# Altium schematic sheet Root.SchDoc
size A3; SheetNumber: 1; SheetTotal: 1
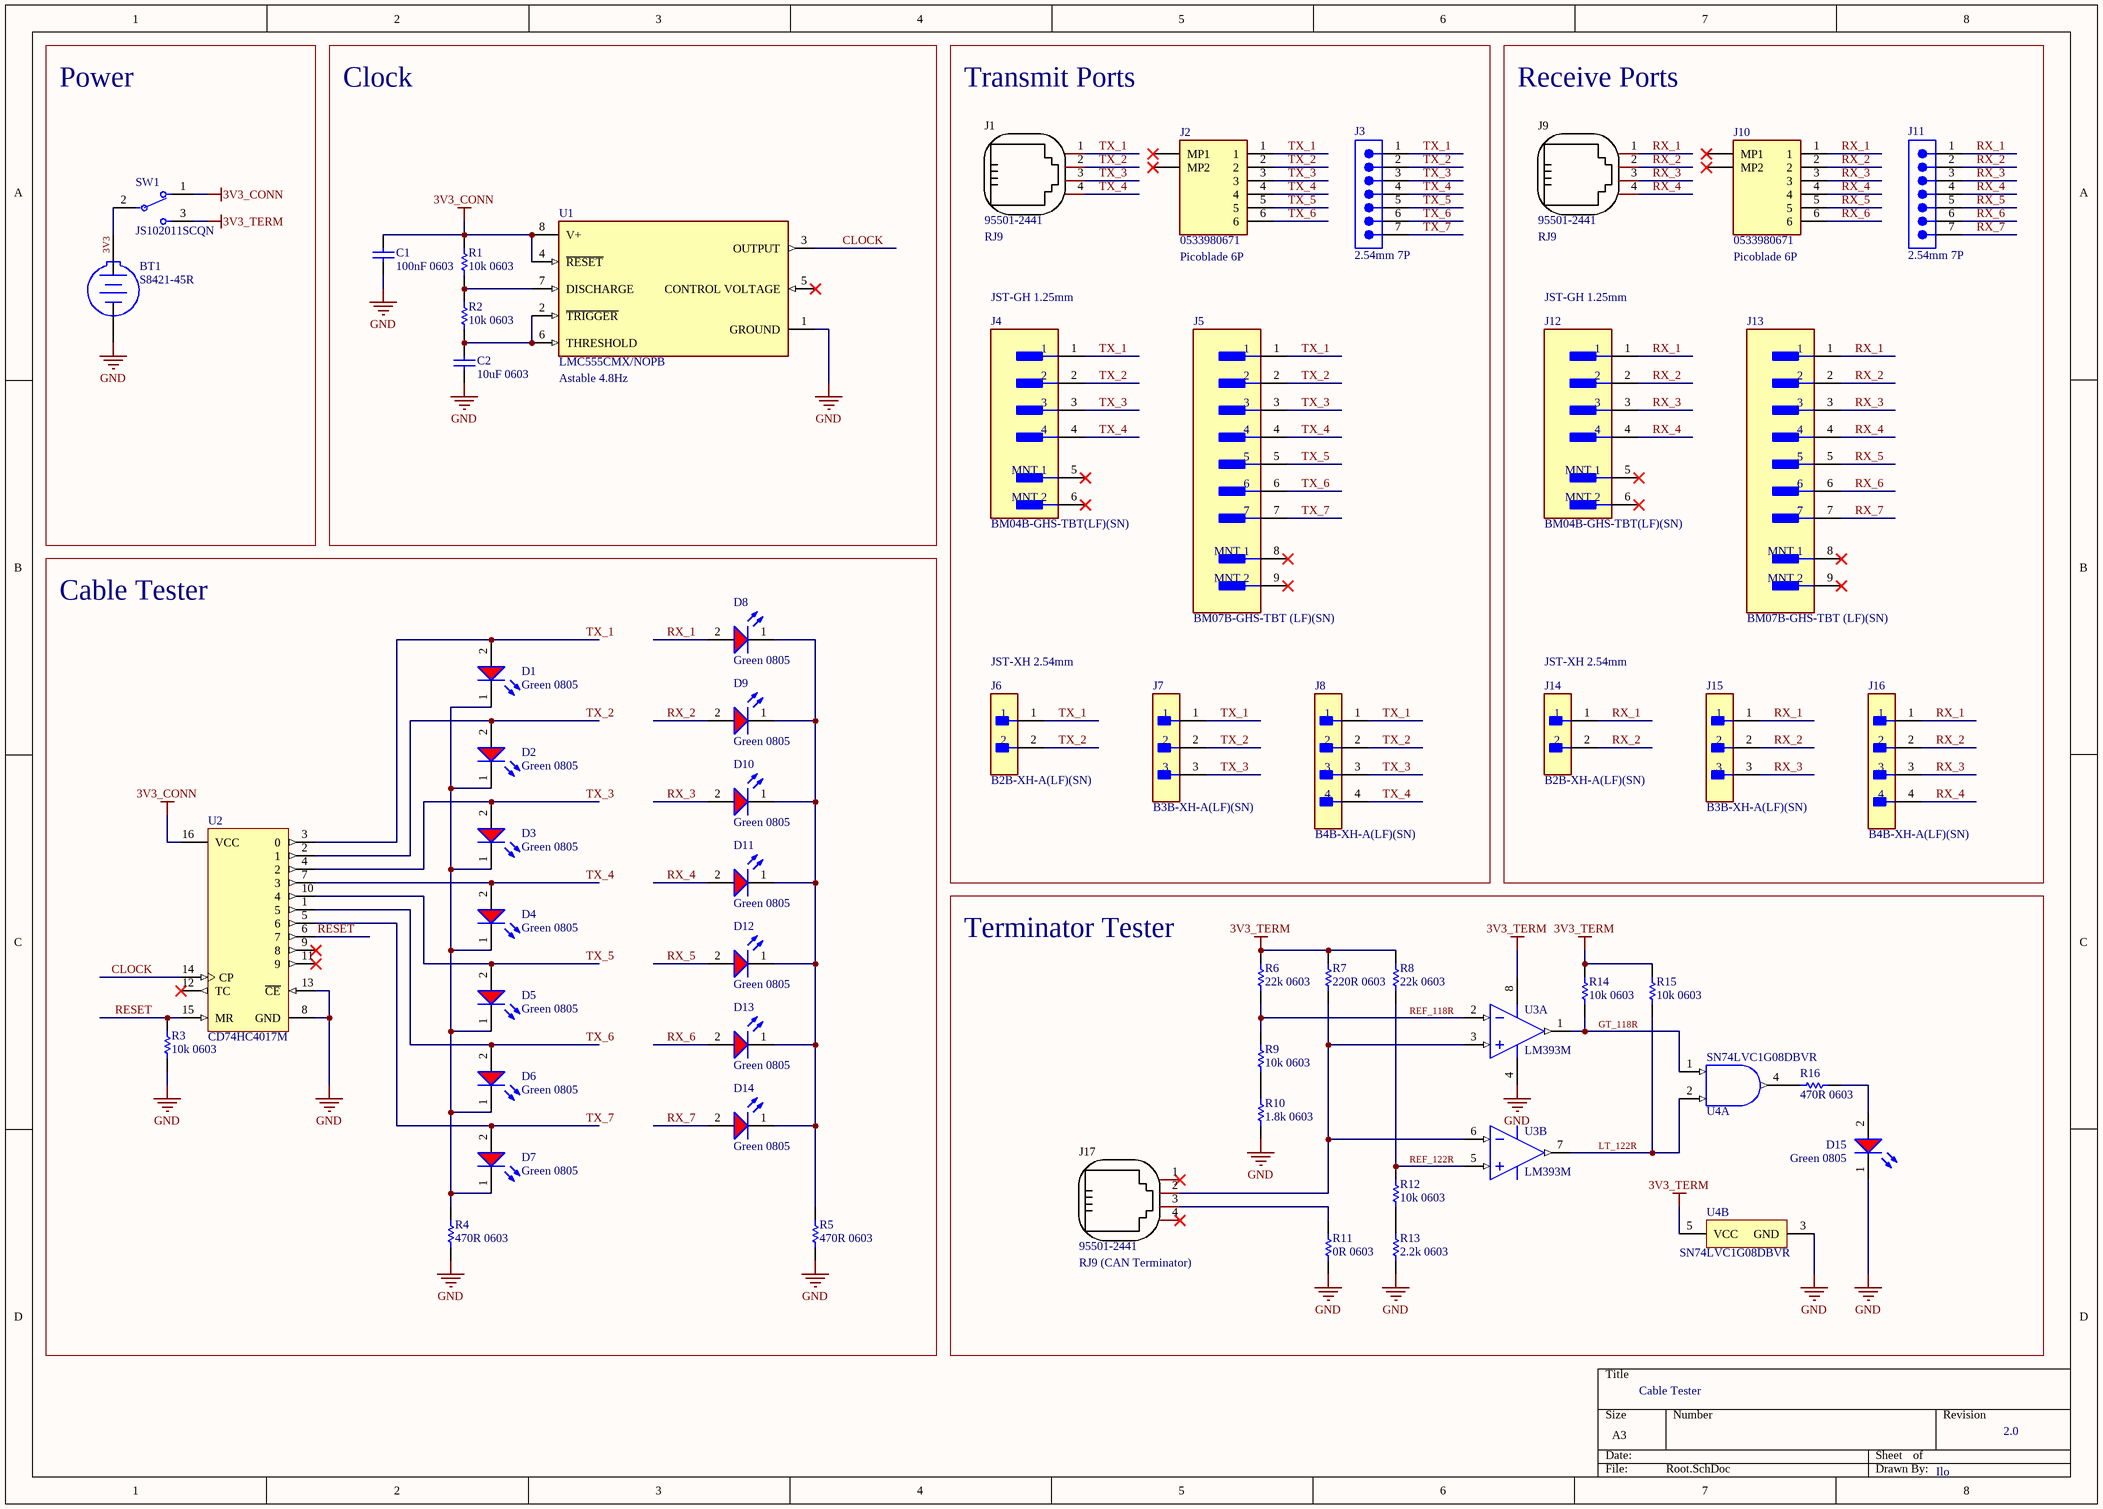
[diagram p0: Root.SchDoc]

## Parts
BT1  S8421-45R  [HRWN-S8421-45R_V]
C1  100nF 0603  [CAPC1608X92X38LL15T08]
C2  10uF 0603  [CAPC1608X92X38LL15T08]
D1  Green 0805  [WL-SMCW_0805_150080xx75000]
D2  Green 0805  [WL-SMCW_0805_150080xx75000]
D3  Green 0805  [WL-SMCW_0805_150080xx75000]
D4  Green 0805  [WL-SMCW_0805_150080xx75000]
D5  Green 0805  [WL-SMCW_0805_150080xx75000]
D6  Green 0805  [WL-SMCW_0805_150080xx75000]
D7  Green 0805  [WL-SMCW_0805_150080xx75000]
D8  Green 0805  [WL-SMCW_0805_150080xx75000]
D9  Green 0805  [WL-SMCW_0805_150080xx75000]
D10  Green 0805  [WL-SMCW_0805_150080xx75000]
D11  Green 0805  [WL-SMCW_0805_150080xx75000]
D12  Green 0805  [WL-SMCW_0805_150080xx75000]
D13  Green 0805  [WL-SMCW_0805_150080xx75000]
D14  Green 0805  [WL-SMCW_0805_150080xx75000]
D15  Green 0805  [WL-SMCW_0805_150080xx75000]
J1  95501-2441  [RJ45-TH_95501-2441]
J2  0533980671  [0533980671]
J3  2.54mm 7P  [61300711121]
J4  BM04B-GHS-TBT(LF)(SN)  [FP-BM04B-GHS-TBT_LF_SN-MFG]
J5  BM07B-GHS-TBT (LF)(SN)  [FP-BM07B-GHS-TBT_LF_SN-MFG]
J6  B2B-XH-A(LF)(SN)  [FP-B2B-XH-A_LF_SN-MFG]
J7  B3B-XH-A(LF)(SN)  [FP-B3B-XH-A_LF_SN-MFG]
J8  B4B-XH-A(LF)(SN)  [FP-B4B-XH-A_LF_SN-MFG]
J9  95501-2441  [RJ45-TH_95501-2441]
J10  0533980671  [0533980671]
J11  2.54mm 7P  [61300711121]
J12  BM04B-GHS-TBT(LF)(SN)  [FP-BM04B-GHS-TBT_LF_SN-MFG]
J13  BM07B-GHS-TBT (LF)(SN)  [FP-BM07B-GHS-TBT_LF_SN-MFG]
J14  B2B-XH-A(LF)(SN)  [FP-B2B-XH-A_LF_SN-MFG]
J15  B3B-XH-A(LF)(SN)  [FP-B3B-XH-A_LF_SN-MFG]
J16  B4B-XH-A(LF)(SN)  [FP-B4B-XH-A_LF_SN-MFG]
J17  95501-2441  [RJ45-TH_95501-2441]
R1  10k 0603  [RESC0603(1608)_L]
R2  10k 0603  [RESC0603(1608)_L]
R3  10k 0603  [RESC0603(1608)_L]
R4  470R 0603  [RESC0603(1608)_L]
R5  470R 0603  [RESC0603(1608)_L]
R6  22k 0603  [RESC0603(1608)_L]
R7  220R 0603  [RESC0603(1608)_L]
R8  22k 0603  [RESC0603(1608)_L]
R9  10k 0603  [RESC0603(1608)_L]
R10  1.8k 0603  [RESC0603(1608)_L]
R11  0R 0603  [RESC0603(1608)_L]
R12  10k 0603  [RESC0603(1608)_L]
R13  2.2k 0603  [RESC0603(1608)_L]
R14  10k 0603  [RESC0603(1608)_L]
R15  10k 0603  [RESC0603(1608)_L]
R16  470R 0603  [RESC0603(1608)_L]
SW1  JS102011SCQN  [FP-JS102011SCQN-MFG]
U1  LMC555CMX/NOPB  [FP-D0008A-MFG]
U2  CD74HC4017M  [D0016A_N]
U3  LM393M  [D0008A_L]  (parts A,B of 2)
U4  SN74LVC1G08DBVR  [DBV0005A_M]  (parts A,B of 2)

## Blocks framed on the sheet
Power: BT1 SW1
Clock: C1 C2 R1 R2 U1
Transmit Ports: J1-J8
Receive Ports: J9-J16
Cable Tester: D1-D14 R3-R5 U2
Terminator Tester: D15 J17 R6-R16 U3 U4

## Nets
3V3_CONN: C1.1 R1.2 SW1.1 U1.4(~{RESET}) U1.8(V+) U2.16(VCC)
3V3_TERM: R6.2 R7.2 R8.2 R14.2 R15.2 SW1.3 U3.8(V+) U4.5(VCC)
GND: BT1.2(-) C1.2 C2.2 D15.1(K) R3.1 R4.1 R5.1 R10.1 R11.1 R13.1 U1.1(GROUND) U2.8(GND) U2.13(~{CE}) U3.4(GND) U4.3(GND)
3V3: BT1.1(+) SW1.2(C)
CLOCK: U1.3(OUTPUT) U2.14(CP)
GT_118R: R14.1 U3.1(OUTA) U4.1(A)
LT_122R: R15.1 U3.7(OUTB) U4.2(B)
REF_118R: R6.1 R9.2 U3.2(INA-)
REF_122R: R8.1 R12.2 U3.5(INB+)
RESET: R3.2 U2.6(7) U2.15(MR)
RX_1: D8.2(A) J9.1 J10.1 J11.1 J12.1 J13.1 J14.1 J15.1 J16.1
RX_2: D9.2(A) J9.2 J10.2 J11.2 J12.2 J13.2 J14.2 J15.2 J16.2
RX_3: D10.2(A) J9.3 J10.3 J11.3 J12.3 J13.3 J15.3 J16.3
RX_4: D11.2(A) J9.4 J10.4 J11.4 J12.4 J13.4 J16.4
RX_5: D12.2(A) J10.5 J11.5 J13.5
RX_6: D13.2(A) J10.6 J11.6 J13.6
RX_7: D14.2(A) J11.7 J13.7
TX_1: D1.2(A) J1.1 J2.1 J3.1 J4.1 J5.1 J6.1 J7.1 J8.1 U2.3(0)
TX_2: D2.2(A) J1.2 J2.2 J3.2 J4.2 J5.2 J6.2 J7.2 J8.2 U2.2(1)
TX_3: D3.2(A) J1.3 J2.3 J3.3 J4.3 J5.3 J7.3 J8.3 U2.4(2)
TX_4: D4.2(A) J1.4 J2.4 J3.4 J4.4 J5.4 J8.4 U2.7(3)
TX_5: D5.2(A) J2.5 J3.5 J5.5 U2.10(4)
TX_6: D6.2(A) J2.6 J3.6 J5.6 U2.1(5)
TX_7: D7.2(A) J3.7 J5.7 U2.5(6)
NetC2_1: C2.1 R2.1 U1.2(~{TRIGGER}) U1.6(THRESHOLD)
NetD1_1: D1.1(K) D2.1(K) D3.1(K) D4.1(K) D5.1(K) D6.1(K) D7.1(K) R4.2
NetD8_1: D8.1(K) D9.1(K) D10.1(K) D11.1(K) D12.1(K) D13.1(K) D14.1(K) R5.2
NetD15_2: D15.2(A) R16.1
NetJ17_2: J17.2 R7.1 U3.3(INA+) U3.6(INB-)
NetJ17_3: J17.3 R11.2
NetR1_1: R1.1 R2.2 U1.7(DISCHARGE)
NetR9_1: R9.1 R10.2
NetR12_1: R12.1 R13.2
NetR16_2: R16.2 U4.4(Y)

Not connected (* = marked no-connect by the designer): J2 MP1* MP2*; J4 5(MNT_1)* 6(MNT_2)*; J5 8(MNT_1)* 9(MNT_2)*; J10 MP1* MP2*; J12 5(MNT_1)* 6(MNT_2)*; J13 8(MNT_1)* 9(MNT_2)*; J17 1* 4*; U1 5(CONTROL_VOLTAGE)*; U2 9(8)* 11(9)* 12(TC)*

## Notes on the sheet
- RJ9
- (near J2) Picoblade 6P
- (near J10) Picoblade 6P
- JST-GH 1.25mm
- (near U1) Astable 4.8Hz
- JST-XH 2.54mm
- (near J17) RJ9 (CAN Terminator)
- Cable Tester
- Ilo
- 2.0

## Library data of the parts
BT1 = CMP-2000-07028-1: Bettery Coin Cell Holder, Suitable for CR2032, -40 to 105 degC, 2-Pin SMD, RoHS, Tape and Reel; Manufacturer: Harwin; Number of Batteries: 1; Battery Cell Size: 20mm; RoHS: Details; Datasheet Version: Rev. 3, 01/2014; Dimensions: 20mm; Product: BatteryHolders; Datasheet URL: https://cdn.harwin.com/pdfs/S8421R.pdf; Package Reference: S8421-45R; Series: S8; Type: BatteryRetainer; Tradename: EZBoardware; Mounting Style: SMD/SMT; Factory Pack Quantity: 500; Package Description: 2-Pin Surface Mount Holder, Body 23.79 x 15.6 mm; Material: PolyphenyleneSulfide(PPS); Mounting Technology: SurfaceMount; Product Category: CoinCellBatteryHolders; Manufacturer URL: https://www.harwin.com/; Packaging: Reel; Brand: Harwin; Contact Plating: PhosphorBronze
C1 C2 = CMP-2006-01972-1: Manufacturer: Vitramon; Part Number: VJ0603Y103KXAAC
D1-D15 = CMP-1426-00011-3: LED Uni-Color Red 630nm 2-Pin Chip 0805(2012Metric) T/R
J1 J9 J17 = 955012441: Manufacturer: MOLEX; Add into BOM: yes; Number of Ports: 1; Symbol: 955012441; Device: 955012441; LCSC Part Name: 955012441; Supplier Part: C293727; Manufacturer Part: 955012441; Supplier Footprint: 插件; JLCPCB Part Class: Extended Part; Datasheet: https://atta.szlcsc.com/upload/public/pdf/source/20181030/C293728_4A841B363173D905FE7362B37B2768C3.pdf; Supplier: LCSC; Convert to PCB: yes; Connector Type: -; Shielding: -; LED: -; Ratings: -
J2 J10 = 0533980671: Connector; Manufacturer_Name: Molex; Datasheet Link: https://www.molex.com/pdm_docs/sd/533980671_sd.pdf; Height: 4.7mm; Manufacturer_Part_Number: 0533980671; Arrow Part Number: 0533980671; Arrow Price/Stock: https://www.arrow.com/en/products/0533980671/molex?region=nac
J3 J11 = CMP-1502-01074-3
J4 J12 = CMP-17439-000062-1: CONN HEADER SMD 4POS 1.25MM; Current Rating: 1A; Number of Positions: 4; Wire/Cable Gauge: 26AWG; Voltage Rating (AC): 50V; Gender: Male; Case/Package: SMD/SMT; Contact Plating: Tin; Housing Color: Natural; Termination: Crimp; Max Operating Temperature: 85°C; Min Operating Temperature: -25°C; REACH SVHC: No SVHC; Voltage Rating: 50V; Lead Free: Lead Free; Pitch: 1.25mm; Number of Rows: 4; Contact Material: Bronze; Housing Material: Nylon; Series: GH; Orientation: Straight; Packaging: Cut Tape; Number of Contacts: 4
J5 J13 = CMP-17439-000607-1: CONN HEADER SMD 7POS 1.25MM; Voltage Rating (AC): 50V; Current Rating: 1A; Wire/Cable Gauge: 26AWG; Number of Positions: 7; Pitch: 1.25mm; Housing Material: Nylon; Max Operating Temperature: 85°C; Termination: SMD/SMT; Number of Rows: 1; Lead Free: Lead Free; Number of Contacts: 7; Reach SVHC Compliant: Yes; Contact Material: Bronze; Packaging: Cut Tape; Series: GH; Contact Plating: Tin; Housing Color: Natural; Min Operating Temperature: -25°C; Mount: Surface Mount
J6 J14 = CMP-2000-05888-3: CONN HEADER VERT 2POS 2.5MM
J7 J15 = CMP-17439-000014-1: CONN HEADER VERT 3POS 2.5MM; Manufacturer: JST; Conn Gender: Male; Conn Orientation: Vertical; Voltage Rating: 250V; Number Of Contacts: 3; Current Rating: 3A; Contact Material: Tin,Copper; Temperature Range Low: -25°C; Octopart: https://octopart.com/b3b-xh-a%28lf%29%28sn%29-jst-3990185; Device Class L3: unset; Device Class L1: Connectors; Lead Free: Yes; Temperature: -25°C to +85°C; Manufacturer Part Number: B3B-XH-A(LF)(SN); Package: 0; ComponentLink2Description: Datasheet; Pitch: 2.5mm; RoHS: TRUE; Category: Conn; Automotive: No; Temperature Range High: +85°C; Height: 7mm; Device Class L2: Headers and Wire Housings; Number Of Rows: 1; Digikey Description: CONN HEADER VERT 3POS 2.5MM; ComponentLink2URL: https://www.jst-mfg.com/product/pdf/eng/eXH.pdf
J8 J16 = CMP-17439-000250-1: CONN HEADER VERT 4POS 2.5MM; Max Voltage Rating (AC): 250V; Max Current Rating: 3A; Contact Resistance: 20mR; Insulation Resistance: 1GR; Number of Positions: 4; Mated Stacking Heights: 9.8mm; Wire/Cable Gauge: 22AWG; Gender: Male; Min Operating Temperature: -25°C; Contact Type: Male Pin; Max Operating Temperature: 85°C; Housing Color: White; Package Quantity: 500; Voltage Rating: 250V; Lead Pitch: 2.5mm; Number of Rows: 1; Current Rating: 3A; Pitch: 2.5mm; Insulation Color: Natural; Housing Material: Polyamide; REACH SVHC: No SVHC; Contact Shape: Square; Contact Plating: Tin; Packaging: Bulk; Termination: Solder; Flammability Rating: UL94 V-0; Max Voltage Rating (DC): 250V; Contact Finish - Mating: TIN; Series: XH; Depth: 5.75mm; Contact Material: Brass; Connector Type: Header; Length: 12.4mm; Mount: Through Hole; Orientation: Straight; Material: Polyamide; Lead Free: Lead Free; Fastening Type: Detent; Voltage Rating (AC): 250V; Number of Contacts: 4; Insulation Material: Nylon; Color: Natural
R1-R16 = CMP-1012-00052-1: 120R 0.1W 5% 0603 (1608 Metric)  SMD; Case-EIA: 0603; Value: 120.00 Ohm; Case-Metric: 1608; Technology: SMT; Power: 0.1 W; Tolerance: 5 %
SW1 = CMP-10038-000023-1: SWITCH SLIDE SPDT 300MA 6V; Actuator Material: Nylon; Actuator Length: 2mm; Actuator Color: Black; Contact Resistance: 70mR; Max Voltage Rating (DC): 30V; Actuator Type: Standard; Switch Function: On-On; Electrical Life: 5000Cycles; Throw Configuration: SPDT; Contact Plating: Silver; Min Operating Temperature: -40°C; RoHS Compliant: Yes; Contact Material: Copper Alloy; Package Quantity: 4000; Mount: Surface Mount; Radiation Hardening: No; Orientation: Straight; Series: JS; Current Rating: 300mA; Termination: Gull Wing; Depth: 7.5mm; Switch Travel: 2mm; Max Current Rating: 300mA; Packaging: Tape and Reel; Length: 8.5mm; Housing Material: Nylon; Max Operating Temperature: 85°C; Case/Package: SMD/SMT; Voltage Rating (DC): 6V
U1 = CMP-04858-000001-1: IC OSC SINGLE TIMER 3MHZ 8-SOIC; Manufacturer: Texas Instruments; Number Of Timers/Counters: 1; Max Supply Voltage: 15V; Standoff Height: 0.11mm; Propagation Delay: 100ns; Nominal Supply Current: 50-150uA; Min Supply Voltage: 1.5V; Octopart: https://octopart.com/lmc555cmx%2Fnopb-texas+instruments-24815227; Frequency: 3MHz; Device Class L2: Clock and Timing; Temperature: -40°C to +85°C; Temperature Range Low: -40°C; Height: 1.75mm; ComponentLink2URL: http://www.ti.com/general/docs/suppproductinfo.tsp?distId=10&gotoUrl=http%3A%2F%2Fwww.ti.com%2Flit%2Fgpn%2Flmc555; Package: D0008A; Device Class L1: Integrated Circuits (ICs); Manufacturer Part Number: LMC555CMX/NOPB; RoHS: TRUE; Lead Free: Yes; Temperature Range High: +85°C; Digikey Description: IC OSC SINGLE TIMER 3MHZ 8-SOIC; Device Class L3: Timers and Oscillators; ComponentLink2Description: Datasheet; Mouser Description: Timers & Support Products CMOS TIMER; Category: IC; Ipc Land Pattern Name: SOIC127P600X175-8; Automotive: No
U2 = CMP-1623-00115-2: High Speed CMOS Logic Decade Counter/Divider with 10 Decoded Outputs, D0016A, TUBE; Manufacturer: Texas Instruments; VCC(Max)(V): 6; Rating: Catalog; tpd @ Nom Voltage(Max)(ns): 54; ICC @ Nom Voltage(Max)(mA): 0.08; Technology Family: HC; VCC(Min)(V): 2; Input Type: LVTTL/CMOS; Schmitt Trigger: No; Voltage(Nom)(V): 3.3,5; Inputs: 1; Bits(#): 10; Output Drive (IOL/IOH)(Max)(mA): 5.2/-5.2; F @ Nom Voltage(Max)(Mhz): 28; Output Type: CMOS; Type: Decade; PackageReference: D0016A; DatasheetVersion: SCHS200D; Operating Temperature Range(C): -55 to 125; Function: Counter; Generic Part Number: CD74HC4017; Code_JEDEC: MS-012 variation AC
U3 = CMP-0055-00682-3: Low Power Low Offset Voltage Dual Comparator, 8-pin Narrow SOIC; Manufacturer: Texas Instruments; CompType: Amplifiers; PowerWise: N; PackageTopMarking: NSZXTT*LM*393M; PinCount: 8; Code_IPC: SOIC127P600-8; RoHS: N; PackageDescription: SOIC Narrow, 4.9 x 3.9 x 1.45mm, 8 Lead, 1.27mm Pitch; ComponentLink1URL: http://www.ti.com/general/docs/lit/getliterature.tsp?genericPartNumber=LM393-N&fileType=pdf; Code_JEDEC: MS-012-AA; ComponentLink1Description: Datasheet URL; Package Reference: D0008A
U4 = CMP-0859-00053-3: Single 2-Input Positive-AND Gate, DBV0005A, LARGE T&R; Manufacturer: Texas Instruments; Logic: True; ICC @ Nom Voltage(Max)(mA): 0.01; VCC(Min)(V): 1.65; Bits(#): 1; Rating: Catalog; Schmitt Trigger: No; Voltage(Nom)(V): 1.8,2.5,3.3,5; Output Drive (IOL/IOH)(Max)(mA): 32/-32; Gate Type: AND; tpd @ Nom Voltage(Max)(ns): 4.5,6,4,5; VCC(Max)(V): 5.5; Output Type: CMOS; F @ Nom Voltage(Max)(Mhz): 150; Input Type: CMOS/TTL; Technology Family: LVC; Sub-Family: AND Gate; PackageReference: DBV0005A; Generic Part Number: SN74LVC1G08; Operating Temperature Range(C): -40 to 125,-40 to 85; 3-State Output: No; DatasheetVersion: SCES217Y